# EasyEDA Pro project codeday-badge.eprj, schematic CodeDay Badge Programmer
Create Date: 2023-03-01; Page Name: Schematic; Project Name: codeday-badge; Schematic Name: CodeDay Badge Programmer; Update Date: 2023-03-01; Company: CQP LLC; Drawed: Tyler Menezes; Page Size: A4; Part Number: JLCPCB-002; Reviewed: Tyler Menezes; Version: V1.0
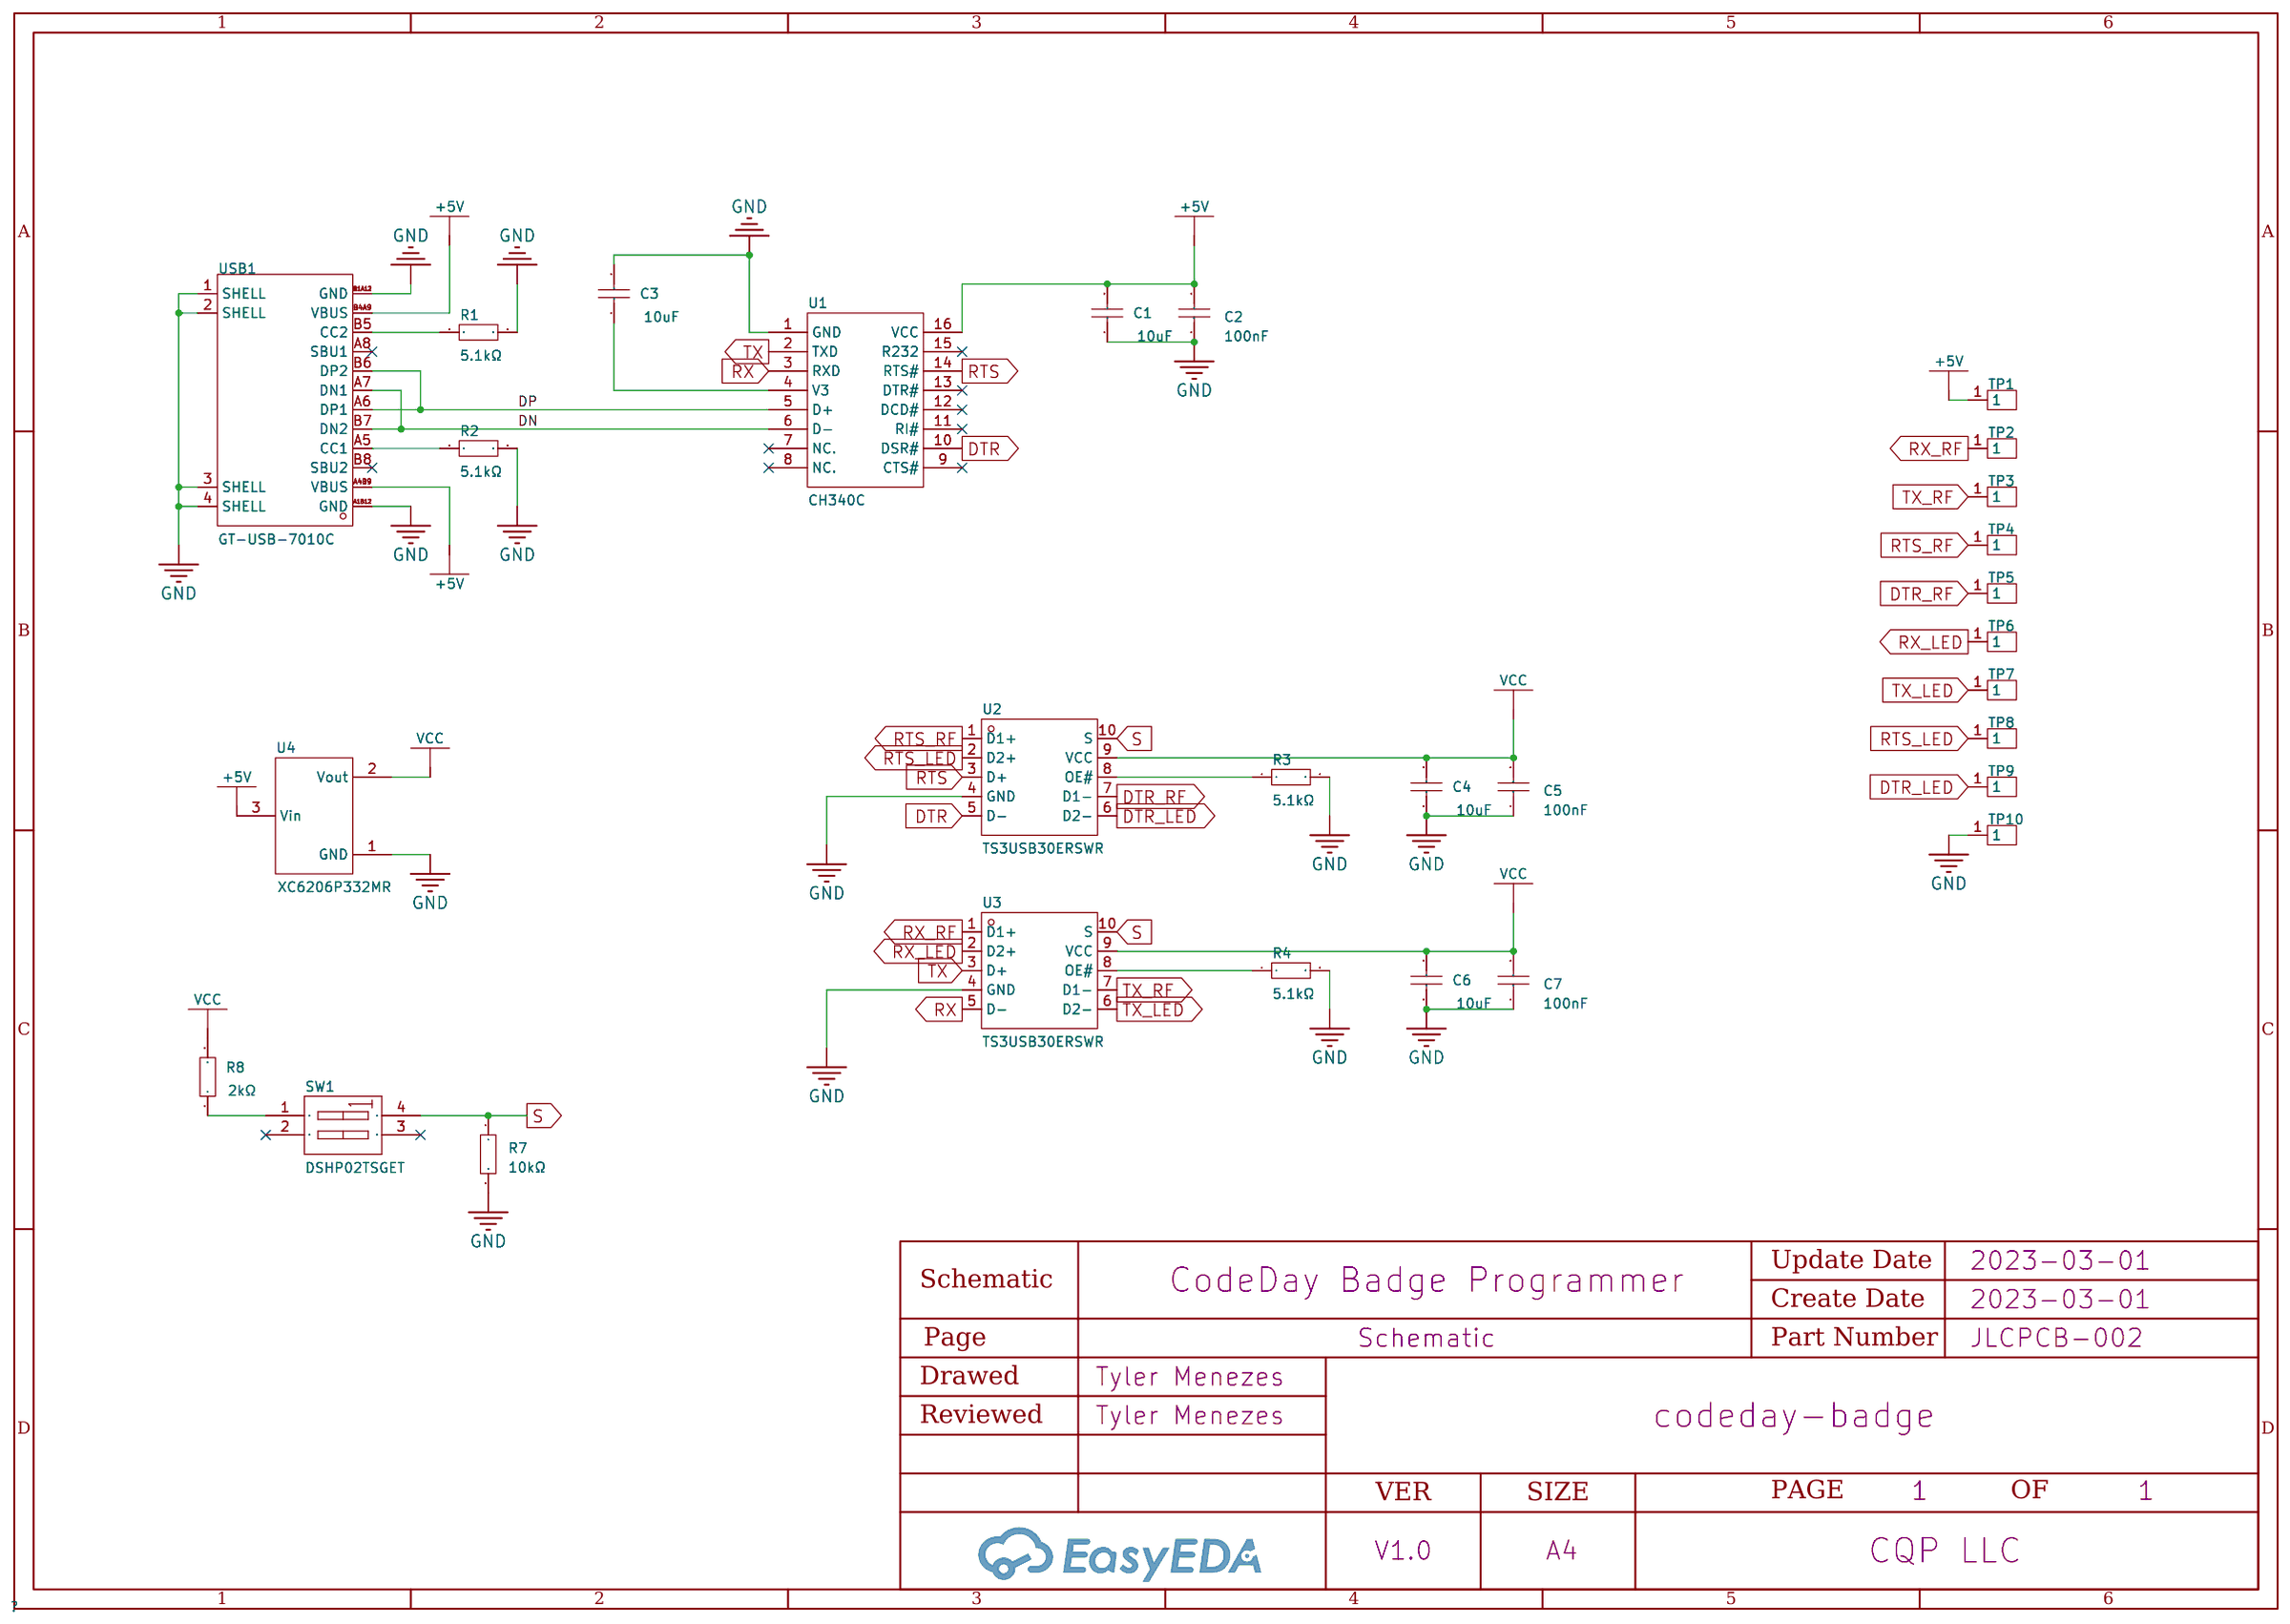
[diagram p3: schematic sheet]

## Parts
C1  10uF  [C0402]
C2  100nF  [C0402_NEW]
C3  10uF  [C0402]
C4  10uF  [C0402]
C5  100nF  [C0402_NEW]
C6  10uF  [C0402]
C7  100nF  [C0402_NEW]
R1  5.1kΩ  [R0402]
R2  5.1kΩ  [R0402]
R3  5.1kΩ  [R0402]
R4  5.1kΩ  [R0402]
R7  10kΩ  [R0402]
R8  2kΩ  [R0402]
SW1  DSHP02TSGET  [SW-SMD_4P_DSHP02TSGET]
TP1  KH-205580-DZ  [SMD_BD2.0-L2.0-W2.0_C9900001905]
TP2  KH-205580-DZ  [SMD_BD2.0-L2.0-W2.0_C9900001905]
TP3  KH-205580-DZ  [SMD_BD2.0-L2.0-W2.0_C9900001905]
TP4  KH-205580-DZ  [SMD_BD2.0-L2.0-W2.0_C9900001905]
TP5  KH-205580-DZ  [SMD_BD2.0-L2.0-W2.0_C9900001905]
TP6  KH-205580-DZ  [SMD_BD2.0-L2.0-W2.0_C9900001905]
TP7  KH-205580-DZ  [SMD_BD2.0-L2.0-W2.0_C9900001905]
TP8  KH-205580-DZ  [SMD_BD2.0-L2.0-W2.0_C9900001905]
TP9  KH-205580-DZ  [SMD_BD2.0-L2.0-W2.0_C9900001905]
TP10  KH-205580-DZ  [SMD_BD2.0-L2.0-W2.0_C9900001905]
U1  CH340C  [SOP-16_L10.0-W3.9-P1.27-LS6.0-BL]
U2  TS3USB30ERSWR  [UQFN-10_L1.8-W1.4-P0.40-TL]
U3  TS3USB30ERSWR  [UQFN-10_L1.8-W1.4-P0.40-TL]
U4  XC6206P332MR  [SOT-23-3_L2.9-W1.6-P1.90-LS2.8-BR]
USB1  GT-USB-7010C  [USB-C-SMD_GT-USB-7010C]

## Library data of the parts
C1 C3 C4 C6 = CL05A106MQ5NUNC: Capacitance: Tolerance:±20% Tolerance:±20% Voltage Rated: Temperature Coefficient:; LCSC Part Name: 10uF ±20% 6.3V; Supplier Part: C15525; Manufacturer: SAMSUNG(三星); Supplier Footprint: 0402; Datasheet: https://atta.szlcsc.com/upload/public/pdf/source/20220823/2B02EE04F8F211D38A52DCB16EB6BEBA.pdf; Supplier: LCSC; Tolerance: ±20%; Check: true
C2 C5 C7 = CL05B104KO5NNNC: Capacitance: Tolerance:±10% Tolerance:±10% Voltage Rated: Temperature Coefficient:; LCSC Part Name: 100nF ±10% 16V; Supplier Part: C1525; Manufacturer: SAMSUNG(三星); Supplier Footprint: 0402; JLCPCB Part Class: Basic Part; Datasheet: https://atta.szlcsc.com/upload/public/pdf/source/20160103/1457707674891.pdf; Supplier: LCSC; Tolerance: ±10%; Check: true
R1-R4 = 0402WGF5101TCE: LCSC Part Name: 5.1KΩ(5101) ±1% 编带; Supplier Part: C25905; Manufacturer: UNI-ROYAL(厚声); Supplier Footprint: 0402; Datasheet: https://atta.szlcsc.com/upload/public/pdf/source/20170920/C25905_1505895107382980911.pdf; Supplier: LCSC
R7 = 0402WGF1002TCE: Type:Thick Film Resistors Resistance: Tolerance:±1% Tolerance:±1% Power(Watts): Temperature Coefficient:±100ppm/℃ Temperature Coefficient:±100ppm/℃ Overload Voltage (Max): Operating Temperature Range:-55℃~+155℃ Operating Temperature Range:-55℃~+155℃; LCSC Part Name: 10kΩ ±1% 62.5mW; Supplier Part: C25744; Manufacturer: UNI-ROYAL(厚声); Supplier Footprint: 0402; Datasheet: https://atta.szlcsc.com/upload/public/pdf/source/20200306/C422600_1E6D84923E4A46A82E41ADD87F860B5C.pdf; Supplier: LCSC; Type: Thick Film Resistors; Tolerance: ±1%; Temperature Coefficient: ±100ppm/℃; Operating Temperature Range: -55℃~+155℃; Check: true
R8 = 0402WGF2001TCE: Type:Thick Film Resistors Resistance: Tolerance:±1% Tolerance:±1% Power(Watts): Temperature Coefficient:±100ppm/℃ Temperature Coefficient:±100ppm/℃ Overload Voltage (Max): Operating Temperature Range:-55℃~+155℃ Operating Temperature Range:-55℃~+155℃; LCSC Part Name: 2kΩ ±1% 62.5mW; Supplier Part: C4109; Manufacturer: UNI-ROYAL(厚声); Supplier Footprint: 0402; Datasheet: https://atta.szlcsc.com/upload/public/pdf/source/20200306/C422600_1E6D84923E4A46A82E41ADD87F860B5C.pdf; Supplier: LCSC; Type: Thick Film Resistors; Tolerance: ±1%; Temperature Coefficient: ±100ppm/℃; Operating Temperature Range: -55℃~+155℃
SW1 = DSHP02TSGET: Type:平拨，Notch式 Circuit:SPST Number of Positions:2 Lead Pitch:1.27mm Color:Black; LCSC Part Name: 2位 1.27间距; Supplier Part: C40735; Manufacturer: YE; Supplier Footprint: SMD-4P,4.1x5.4mm; JLCPCB Part Class: Extended Part; Datasheet: https://atta.szlcsc.com/upload/public/pdf/source/20150928/1457707425261.pdf; Supplier: LCSC; Type: 平拨，Notch式; Circuit: SPST; Number of Positions: 2; Lead Pitch: 1.27mm; Color: Black
TP1-TP10 = KH-205580-DZ: LCSC Part Name: 天线顶针; Supplier Part: C530677; Manufacturer: kinghelm(金航标); JLCPCB Part Class: Extended Part; Datasheet: https://atta.szlcsc.com/upload/public/pdf/source/20200512/C530677_51B225F54ADCA828DFEDE274CE428796.pdf; Supplier: LCSC
U1 = CH340C: Applications Function: Protocol: Data Rate:2Mbps Supply Voltage:3.3V；5V Supply Voltage:3.3V；5V; Supplier Part: C84681; Manufacturer: WCH(南京沁恒); Supplier Footprint: SOP-16; Datasheet: https://atta.szlcsc.com/upload/public/pdf/source/20200819/C84681_ADBED554CE321879DBD6B1D06488689C.pdf; Supplier: LCSC; Data Rate: 2Mbps; Supply Voltage: 3.3V；5V
U2 U3 = TS3USB30ERSWR: Switch Circuit:-; Supplier Part: C73880; Manufacturer: TI(德州仪器); Supplier Footprint: UQFN-10; Supplier: LCSC
U4 = XC6206P332MR_C5446: Output Type: Output Polarity:Positive Number of Outputs:1 Maximum Input Voltage:6V Output Voltage:3.3V~3.3V Output Voltage:3.3V~3.3V Dropout Voltage:680mV@(100mA) Output Current:200mA Power Supply Rejection Ratio (PSRR):-; LCSC Part Name: 正 Vin=6V Vout=3.3V 200mA; Supplier Part: C5446; Manufacturer: TOREX(特瑞仕); Supplier Footprint: SOT-23-3L; JLCPCB Part Class: Basic Part; Datasheet: https://atta.szlcsc.com/upload/public/pdf/source/20130801/1457706628791.pdf; Supplier: LCSC; Output Polarity: Positive; Number of Outputs: 1; Maximum Input Voltage: 6V; Output Voltage: 3.3V~3.3V; Dropout Voltage: 680mV@(100mA); Output Current: 200mA; Check: true
USB1 = GT-USB-7010C: Supplier Part: C2843967; Manufacturer: G-Switch(品赞); Supplier Footprint: SMD; Datasheet: https://atta.szlcsc.com/upload/public/pdf/source/20210810/5173C1CD68B2287784342313366C3CE4.pdf; Supplier: LCSC

## Nets
+5V: C1.2 C2.2 TP1.1 U1.16(VCC) U4.3(Vin) USB1.A4B9(VBUS) USB1.B4A9(VBUS)
GND: C1.1 C2.1 C3.2 C4.1 C5.1 C6.1 C7.1 R1.2 R2.2 R3.2 R4.2 R7.2 TP10.1 U1.1(GND) U2.4(GND) U3.4(GND) U4.1(GND) USB1.1(SHELL) USB1.2(SHELL) USB1.3(SHELL) USB1.4(SHELL) USB1.A1B12(GND) USB1.B1A12(GND)
VCC: C4.2 C5.2 C6.2 C7.2 R8.2 U2.9(VCC) U3.9(VCC) U4.2(Vout)
DN: U1.6(D-) USB1.A7(DN1) USB1.B7(DN2)
DP: U1.5(D+) USB1.A6(DP1) USB1.B6(DP2)
DTR: U1.10(DSR#) U2.5(D-)
DTR_LED: TP9.1 U2.6(D2-)
DTR_RF: TP5.1 U2.7(D1-)
RTS: U1.14(RTS#) U2.3(D+)
RTS_LED: TP8.1 U2.2(D2+)
RTS_RF: TP4.1 U2.1(D1+)
RX: U1.3(RXD) U3.5(D-)
RX_LED: TP6.1 U3.2(D2+)
RX_RF: TP2.1 U3.1(D1+)
S: R7.1 SW1.4(B1) U2.10(S) U3.10(S)
TX: U1.2(TXD) U3.3(D+)
TX_LED: TP7.1 U3.6(D2-)
TX_RF: TP3.1 U3.7(D1-)
$1N2326: R1.1 USB1.B5(CC2)
$1N2338: R2.1 USB1.A5(CC1)
$1N2857: C3.1 U1.4(V3)
$1N5374: R3.1 U2.8(OE#)
$1N5478: R4.1 U3.8(OE#)
$1N7631: R8.1 SW1.1(A1)

Not connected (* = marked no-connect by the designer): SW1 2(A2)* 3(B2)*; U1 7(NC.)* 8(NC.)* 9(CTS#)* 11(RI#)* 12(DCD#)* 13(DTR#)* 15(R232)*; USB1 A8(SBU1)* B8(SBU2)*
